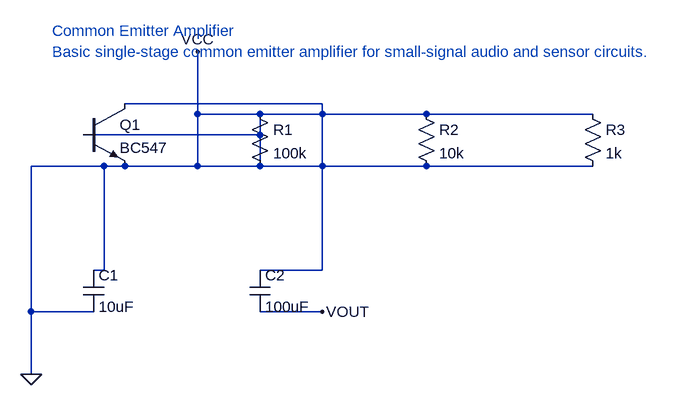
[diagram p0: schematic common_emitter_before.asc]
common_emitter_before.asc, the LTspice schematic file:
Version 4
SHEET 1 1200 800
TEXT 16 16 Left 2 ;Common Emitter Amplifier
TEXT 16 48 Left 2 ;Basic single-stage common emitter amplifier for small-signal audio and sensor circuits.
SYMBOL npn 64 128 R0
SYMATTR InstName Q1
SYMATTR Value BC547
SYMBOL res 320 128 R0
SYMATTR InstName R1
SYMATTR Value 100k
SYMBOL res 576 128 R0
SYMATTR InstName R2
SYMATTR Value 10k
SYMBOL res 832 128 R0
SYMATTR InstName R3
SYMATTR Value 1k
SYMBOL cap 64 384 R0
SYMATTR InstName C1
SYMATTR Value 10uF
SYMBOL cap 320 384 R0
SYMATTR InstName C2
SYMATTR Value 100uF
FLAG 240 48 VCC
WIRE 336 144 240 144
WIRE 240 144 240 48
WIRE 848 224 240 224
WIRE 240 224 240 48
WIRE 336 224 336 176
WIRE 64 176 336 176
WIRE 592 144 336 144
WIRE 336 144 336 176
FLAG -16 544 0
WIRE 592 224 -16 224
WIRE -16 224 -16 544
WIRE 80 448 -16 448
WIRE -16 448 -16 544
WIRE 128 128 432 128
WIRE 432 128 432 224
WIRE 848 144 432 144
WIRE 432 144 432 224
WIRE 336 384 432 384
WIRE 432 384 432 224
WIRE 128 224 96 224
WIRE 96 224 96 304
WIRE 80 384 96 384
WIRE 96 384 96 304
FLAG 432 448 VOUT
WIRE 336 448 432 448

The netlist it stands for:
* common_emitter_before.asc
Q1 0 0 0 0 BC547
R1 0 0 100k
R2 0 0 10k
R3 0 0 1k
C1 0 0 10uF
C2 0 VOUT 100uF
.model NPN NPN
.model PNP PNP
.lib standard.bjt
* Common Emitter Amplifier
* Basic single-stage common emitter amplifier for small-signal audio and sensor circuits.
.backanno
.end